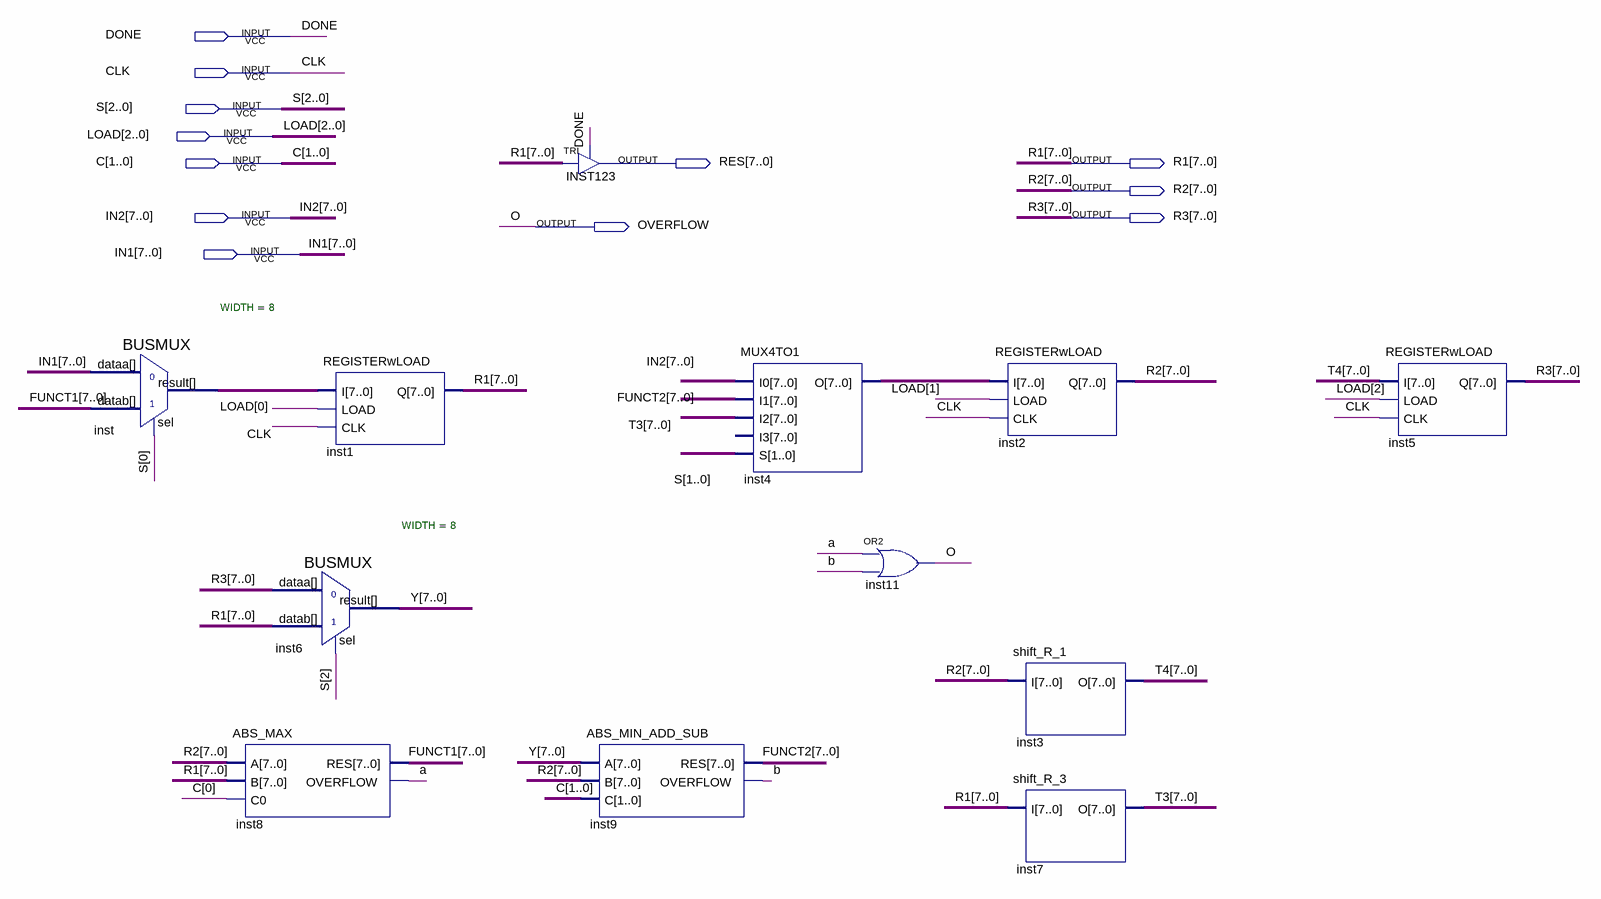
[diagram p0: schematic sheet]
// Quartus schematic DATAPATH_2.bdf as structural Verilog: 12 symbols, 12 pins
module DATAPATH_2 (
  input  DONE,
  input  CLK,
  input  [2:0] S,
  input  [2:0] LOAD,
  input  [1:0] C,
  input  [7:0] IN2,
  input  [7:0] IN1,
  output [7:0] RES,
  output [7:0] R1,
  output [7:0] R2,
  output [7:0] R3,
  output OVERFLOW
);

  wire a, b;
  wire [7:0] FUNCT1, FUNCT2, inst4_o, inst_result, T3, T4, Y;

  BUSMUX #(.WIDTH(8)) inst (.datab(FUNCT1), .sel(S[0]), .dataa(IN1), .result(inst_result));
  BUSMUX #(.WIDTH(8)) inst6 (.datab(R1), .sel(S[2]), .dataa(R3), .result(Y));
  ABS_MAX inst8 (.A(R2), .B(R1), .C0(C[0]), .RES(FUNCT1), .OVERFLOW(a));
  REGISTERwLOAD inst1 (.I(inst_result), .LOAD(LOAD[0]), .CLK(CLK), .Q(R1));
  TRI INST123[7:0] (.IN(R1), .OE(DONE), .OUT(RES));
  ABS_MIN_ADD_SUB inst9 (.A(Y), .B(R2), .C(C), .RES(FUNCT2), .OVERFLOW(b));
  MUX4TO1 inst4 (.I0(IN2), .I1(FUNCT2), .I2(T3), .S(S[1:0]), .O(inst4_o));  // open: I3
  or inst11 (OVERFLOW, a, b);
  REGISTERwLOAD inst2 (.I(inst4_o), .LOAD(LOAD[1]), .CLK(CLK), .Q(R2));
  shift_R_1 inst3 (.I(R2), .O(T4));
  shift_R_3 inst7 (.I(R1), .O(T3));
  REGISTERwLOAD inst5 (.I(T4), .LOAD(LOAD[2]), .CLK(CLK), .Q(R3));

  // Other names for the same wires on the sheet: O = OVERFLOW
endmodule
